# Altium schematic sheet Ten-channel-power-supply.SchDoc
size A4; SheetNumber: 1; SheetTotal: 1
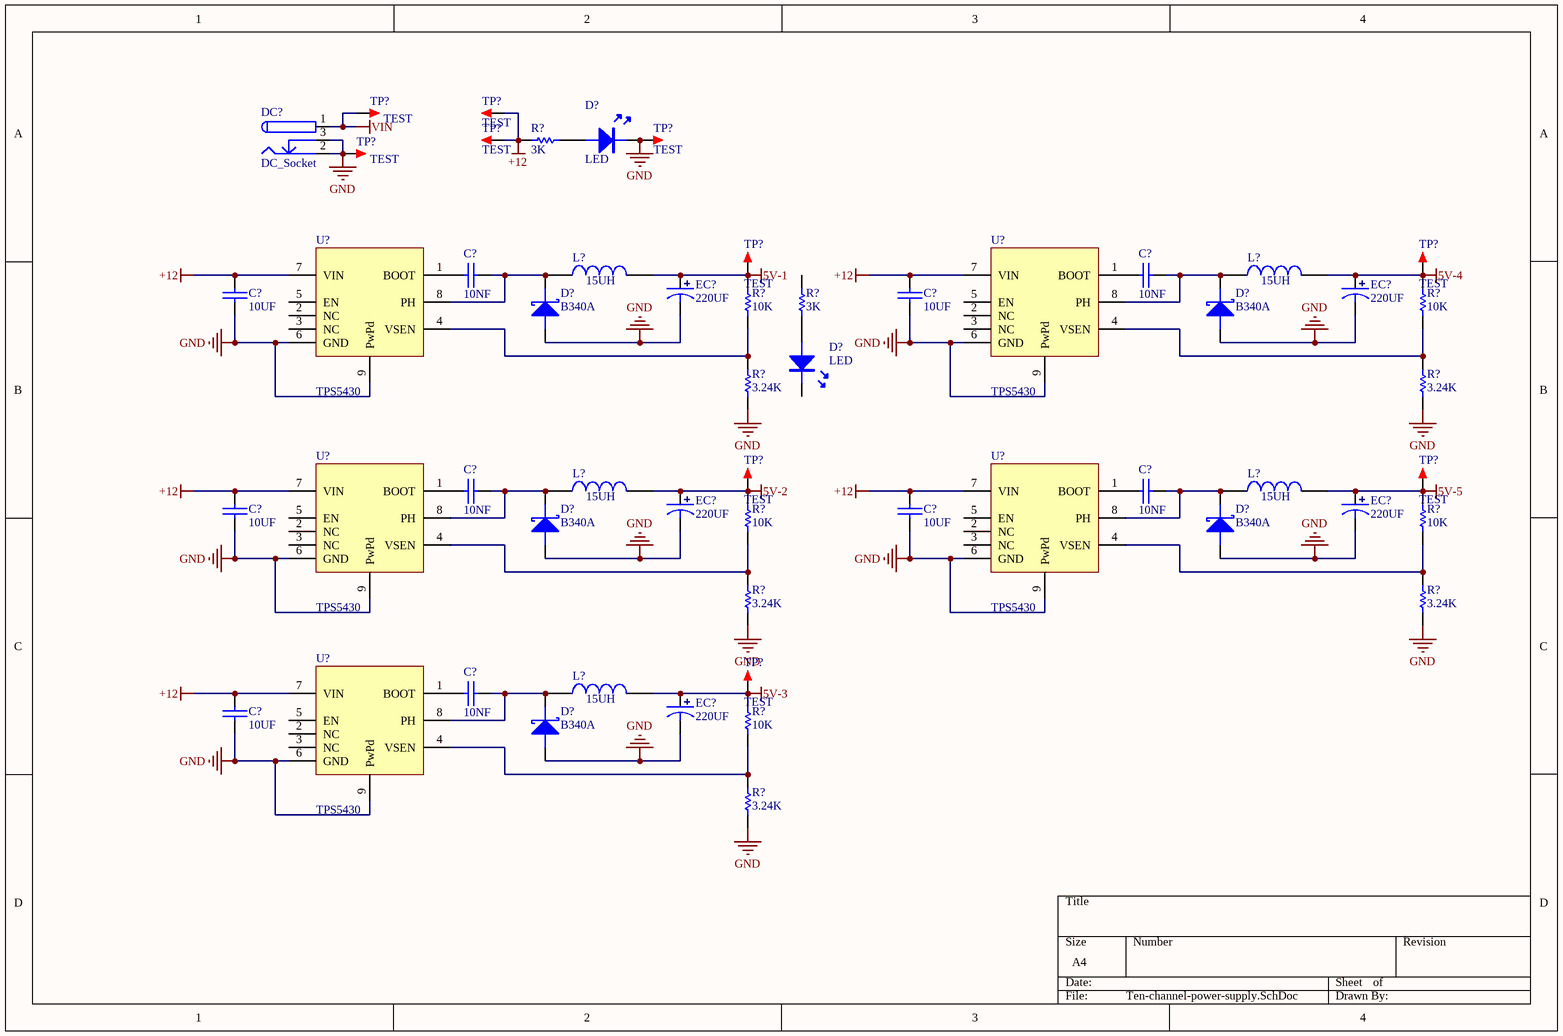
[diagram p0: Ten-channel-power-supply.SchDoc]

## Parts
(Parts that share a designator on the sheet are numbered #1, #2 ... from top to bottom, then left to right.)
C?#1  10NF  [0201C]
C?#2  10NF  [0201C]
C?#3  10UF  [0201C]
C?#4  10UF  [0201C]
C?#5  10NF  [0201C]
C?#6  10NF  [0201C]
C?#7  10UF  [0201C]
C?#8  10UF  [0201C]
C?#9  10NF  [0201C]
C?#10  10UF  [0201C]
D?#1  LED  [LED5-BLUE]
D?#2  LED  [LED5-BLUE]
D?#3  B340A  [DO-15]
D?#4  B340A  [DO-15]
D?#5  B340A  [DO-15]
D?#6  B340A  [DO-15]
D?#7  B340A  [DO-15]
DC?  DC_Socket  [DC-002]
EC?#1  220UF  [SMD-EC3.0X3.3X5.4]
EC?#2  220UF  [SMD-EC3.0X3.3X5.4]
EC?#3  220UF  [SMD-EC3.0X3.3X5.4]
EC?#4  220UF  [SMD-EC3.0X3.3X5.4]
EC?#5  220UF  [SMD-EC3.0X3.3X5.4]
L?#1  15UH  [AL0204]
L?#2  15UH  [AL0204]
L?#3  15UH  [AL0204]
L?#4  15UH  [AL0204]
L?#5  15UH  [AL0204]
R?#1  3K  [0201R]
R?#2  10K  [0201R]
R?#3  3K  [0201R]
R?#4  10K  [0201R]
R?#5  3.24K  [0201R]
R?#6  3.24K  [0201R]
R?#7  10K  [0201R]
R?#8  10K  [0201R]
R?#9  3.24K  [0201R]
R?#10  3.24K  [0201R]
R?#11  10K  [0201R]
R?#12  3.24K  [0201R]
TP?#1  TEST  [TEST 1.6]
TP?#2  TEST  [TEST 1.6]
TP?#3  TEST  [TEST 1.6]
TP?#4  TEST  [TEST 1.6]
TP?#5  TEST  [TEST 1.6]
TP?#6  TEST  [TEST 1.6]
TP?#7  TEST  [TEST 1.6]
TP?#8  TEST  [TEST 1.6]
TP?#9  TEST  [TEST 1.6]
TP?#10  TEST  [TEST 1.6]
U?#1  TPS5430  [SOP8-Pad]
U?#2  TPS5430  [SOP8-Pad]
U?#3  TPS5430  [SOP8-Pad]
U?#4  TPS5430  [SOP8-Pad]
U?#5  TPS5430  [SOP8-Pad]

## Nets
5V-1: EC?#1.1 L?#1.2 R?#2.2 TP?#6.1
5V-2: EC?#3.1 L?#3.2 R?#7.2 TP?#8.1
5V-3: EC?#5.1 L?#5.2 R?#11.2 TP?#10.1
5V-4: EC?#2.1 L?#2.2 R?#4.2 TP?#7.1
5V-5: EC?#4.1 L?#4.2 R?#8.2 TP?#9.1
+12: C?#3.2 C?#4.2 C?#7.2 C?#8.2 C?#10.2 R?#1.2 TP?#2.1 TP?#3.1 U?#1.7(VIN) U?#2.7(VIN) U?#3.7(VIN) U?#4.7(VIN) U?#5.7(VIN)
GND: C?#3.1 C?#4.1 C?#7.1 C?#8.1 C?#10.1 D?#1.K D?#3.A D?#4.A D?#5.A D?#6.A D?#7.A DC?.2 DC?.3 EC?#1.2 EC?#2.2 EC?#3.2 EC?#4.2 EC?#5.2 R?#5.1 R?#6.1 R?#9.1 R?#10.1 R?#12.1 TP?#4.1 TP?#5.1 U?#1.6(GND) U?#1.9(PwPd) U?#2.6(GND) U?#2.9(PwPd) U?#3.6(GND) U?#3.9(PwPd) U?#4.6(GND) U?#4.9(PwPd) U?#5.6(GND) U?#5.9(PwPd)
VIN: DC?.1 TP?#1.1
NetC?#1_1: C?#1.1 U?#1.1(BOOT)
NetC?#1_2: C?#1.2 D?#3.K L?#1.1 U?#1.8(PH)
NetC?#2_1: C?#2.1 U?#2.1(BOOT)
NetC?#2_2: C?#2.2 D?#4.K L?#2.1 U?#2.8(PH)
NetC?#5_1: C?#5.1 U?#3.1(BOOT)
NetC?#5_2: C?#5.2 D?#5.K L?#3.1 U?#3.8(PH)
NetC?#6_1: C?#6.1 U?#4.1(BOOT)
NetC?#6_2: C?#6.2 D?#6.K L?#4.1 U?#4.8(PH)
NetC?#9_1: C?#9.1 U?#5.1(BOOT)
NetC?#9_2: C?#9.2 D?#7.K L?#5.1 U?#5.8(PH)
NetD?#1_A: D?#1.A R?#1.1
NetD?#2_A: D?#2.A R?#3.1
NetR?#2_1: R?#2.1 R?#5.2 U?#1.4(VSEN)
NetR?#4_1: R?#4.1 R?#6.2 U?#2.4(VSEN)
NetR?#7_1: R?#7.1 R?#9.2 U?#3.4(VSEN)
NetR?#8_1: R?#8.1 R?#10.2 U?#4.4(VSEN)
NetR?#11_1: R?#11.1 R?#12.2 U?#5.4(VSEN)

Not connected (* = marked no-connect by the designer): D?#2 K; R?#3 2; U?#1 2(NC) 3(NC) 5(EN); U?#2 2(NC) 3(NC) 5(EN); U?#3 2(NC) 3(NC) 5(EN); U?#4 2(NC) 3(NC) 5(EN); U?#5 2(NC) 3(NC) 5(EN)

## Library data of the parts
C?#1-C?#10 = CAP: 无极性电容
D?#3-D?#7 = DIODE SCHOTTKY: 肖特基二极管
EC?#1-EC?#5 = SMD_ECAP: 贴片电解电容
L?#1-L?#5 = INDUCTOR
R?#1-R?#12 = RES
TP?#1-TP?#10 = TEST: 测试点; 联系卖家，免费查找封装: 唯一出售店铺网址https://shop463601444.taobao.com; BOM名称: 测试点